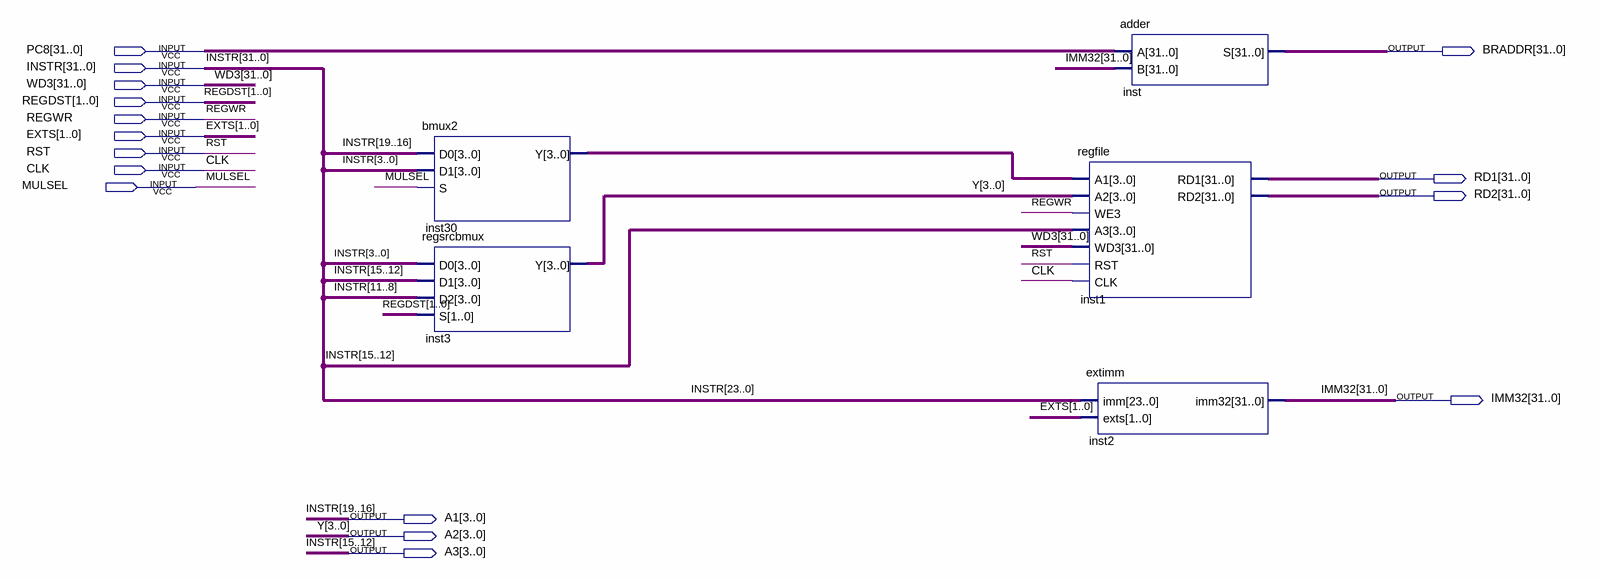
[diagram p0: schematic sheet]
// Quartus schematic decode.bdf as structural Verilog: 5 symbols, 16 pins
module decode (
  input  [31:0] PC8,
  input  [31:0] INSTR,
  input  [31:0] WD3,
  input  [1:0] REGDST,
  input  REGWR,
  input  [1:0] EXTS,
  input  RST,
  input  CLK,
  input  MULSEL,
  output [31:0] BRADDR,
  output [31:0] RD1,
  output [31:0] RD2,
  output [31:0] IMM32,
  output [3:0] A1,
  output [3:0] A2,
  output [3:0] A3
);

  wire [3:0] inst30_y;

  bmux2 inst30 (.D0(INSTR[19:16]), .D1(INSTR[3:0]), .S(MULSEL), .Y(inst30_y));
  regsrcbmux inst3 (.D0(INSTR[3:0]), .D1(INSTR[15:12]), .D2(INSTR[11:8]), .S(REGDST), .Y(A2));
  regfile inst1 (
    .A1(inst30_y), .A2(A2), .WE3(REGWR), .A3(INSTR[15:12]), .WD3(WD3), .RST(RST), .CLK(CLK), .RD1(RD1),
    .RD2(RD2));
  adder inst (.A(PC8), .B(IMM32), .S(BRADDR));
  extimm inst2 (.imm(INSTR[23:0]), .exts(EXTS), .imm32(IMM32));

  assign A1 = INSTR[19:16];
  assign A3 = INSTR[15:12];

  // Other names for the same wires on the sheet: Y[3:0] = A2
endmodule
